# Altium schematic sheet Main.SchDoc
size 127 x 50 mm
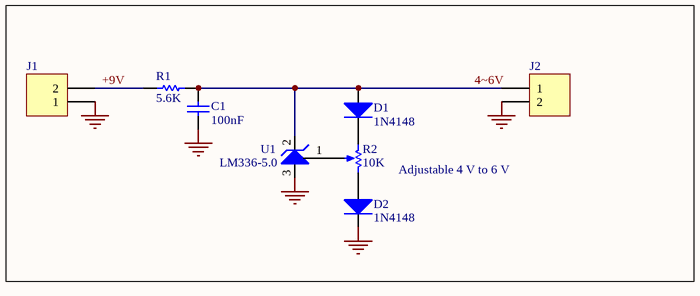
[diagram p0: Main.SchDoc]

## Parts
C1  value 100nF  [CAPNTO2.54-3.05x1.78A]  (hidden comment: Cap)
D1  1N4148  [DIODE0.4_Glass]
D2  1N4148  [DIODE0.4_Glass]
J1  2PIN  [HDR1X2]  (value not drawn)
J2  2PIN  [HDR1X2]  (value not drawn)
R1  value 5.6K  [AXIAL-0.4]  (hidden comment: Res1)
R2  value 10K  [VR4_]  (hidden comment: POT)
U1  LM336-5.0  [TO92C]

## Nets
GND: C1.2 D2.2(K) J1.1 J2.2 U1.3(-)
4~6V: C1.1 D1.1(A) J2.1 R1.1 U1.2(+)
+9V: J1.2 R1.2
NetD1_2: D1.2(K) R2.2(BOT)
NetD2_1: D2.1(A) R2.1(TOP)
NetR2_3: R2.3(TAP) U1.1(Adj)

## Notes on the sheet
- Adjustable 4 V to 6 V

## Library data of the parts
C1 = Cap: Capacitor; Manufacturer: Generic Components; Class I: Passive; Published: 8-Jun-2000; Revision: July-2002: Re-released for DXP Platform.; Publisher: Altium Limited; Class II: Capacitor
D1 D2 = Diode: Default Diode; Manufacturer: Generic Components; Class I: Discrete; Class II: Diode - Switching; Published: 8-Jun-2000; Revision: July-2002: Re-released for DXP Platform.; Publisher: Altium Limited
J1 J2 = Header 2: Header, 2-Pin; Manufacturer: Generic Components; Class I: Connector; Revision: July-2002: Re-released for DXP Platform.; Publisher: Altium Limited
R1 = Res1: Resistor; Published: 8-Jun-2000; LatestRevisionDate: 17-Jul-2002; LatestRevisionNote: Re-released for DXP Platform.; PackageReference: AXIAL-0.3; Publisher: Altium Limited
R2 = RPot1: Potentiometer; Manufacturer: Generic Components; Class I: Passive; Set Position: 0.5; Published: 8-Jun-2000; Revision: July-2002: Re-released for DXP Platform.; Publisher: Altium Limited; Class II: Potentiometer
U1 = LM336: Programmable Shunt Regulator; Value: +5V; Revision: July-2002: Re-released for DXP Platform.